# EAGLE schematic Capture_Points_Arduino_nRF24L01_Eagle (EAGLE 9.0.1)
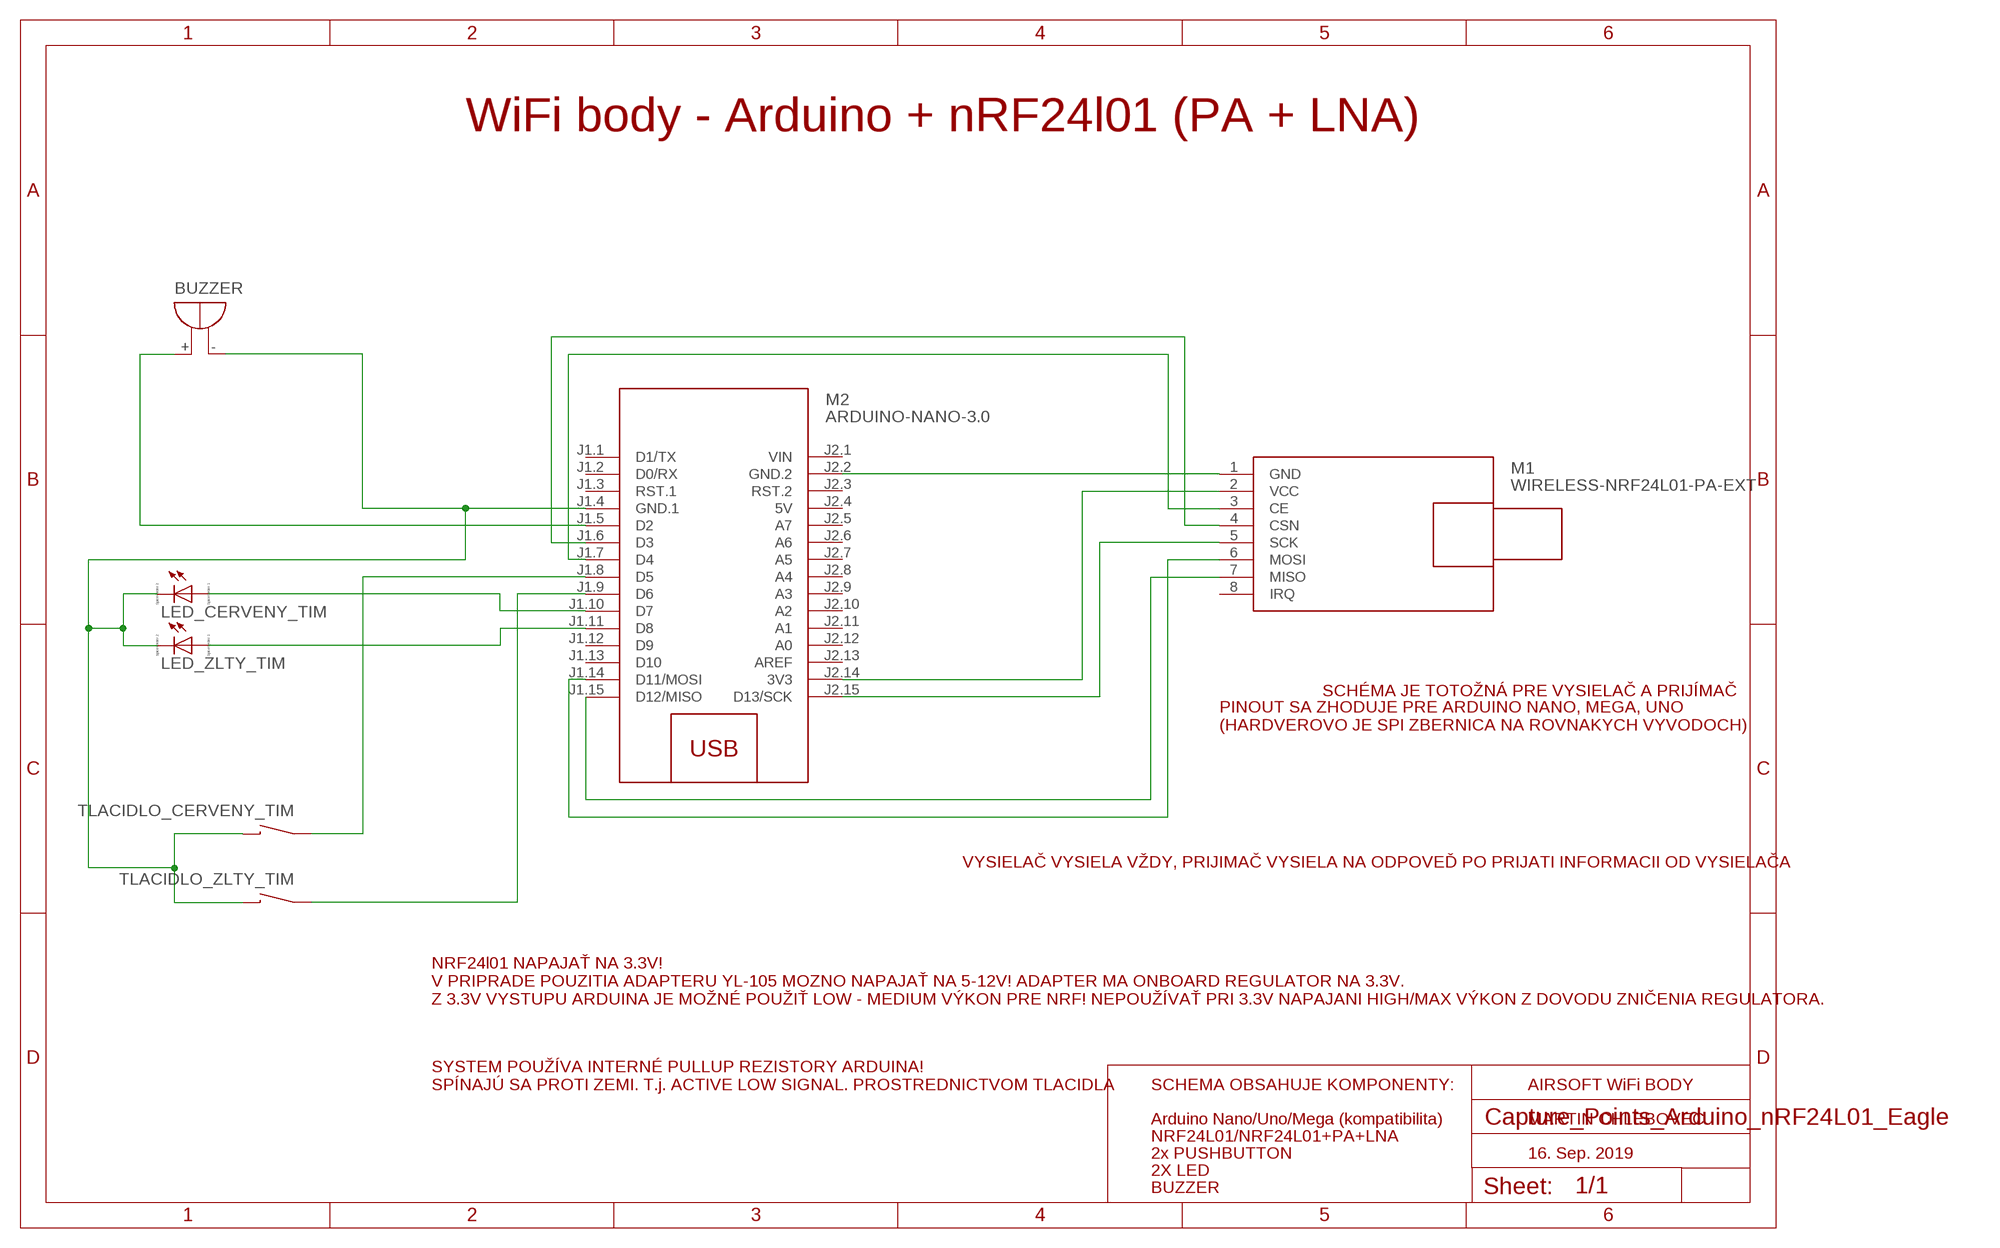
[diagram p0: schematic, sheet 1]

## Parts
BUZZER  F/BC40  [F/BC40]
LED_CERVENY_TIM  LED_E  [LED_1206]
LED_ZLTY_TIM  LED_E  [LED_1206]
M1  WIRELESS-NRF24L01-PA-EXT  [WIRELESS-NRF24L01-PA-EXT]
M2  ARDUINO-NANO-3.0  [ARDUINO-NANO-3.0]
TLACIDLO_CERVENY_TIM  FINGERPAD-2B  [FINGERPAD-2B]
TLACIDLO_ZLTY_TIM  FINGERPAD-2B  [FINGERPAD-2B]

## Nets
N$1: M1.3(CE) M2.J1.7(D4)
N$2: M1.1(GND) M2.J2.2(GND.2)
N$3: M1.2(VCC) M2.J2.14(3V3)
N$4: M1.4(CSN) M2.J1.6(D3)
N$5: M1.5(SCK) M2.J2.15(D13/SCK)
N$6: M1.6(MOSI) M2.J1.14(D11/MOSI)
N$7: M1.7(MISO) M2.J1.15(D12/MISO)
N$8: BUZZER.- LED_CERVENY_TIM.C LED_ZLTY_TIM.C M2.J1.4(GND.1) TLACIDLO_CERVENY_TIM.2 TLACIDLO_ZLTY_TIM.2
N$9: BUZZER.+ M2.J1.5(D2)
N$10: LED_CERVENY_TIM.A M2.J1.10(D7)
N$11: LED_ZLTY_TIM.A M2.J1.11(D8)
N$13: M2.J1.8(D5) TLACIDLO_CERVENY_TIM.1
N$14: M2.J1.9(D6) TLACIDLO_ZLTY_TIM.1
Unconnected: M1.8(IRQ) M2.J1.1(D1/TX) M2.J1.2(D0/RX) M2.J1.3(RST.1) M2.J1.12(D9) M2.J1.13(D10) M2.J2.3(RST.2) M2.J2.5(A7) M2.J2.6(A6) M2.J2.7(A5) M2.J2.8(A4) M2.J2.9(A3) M2.J2.10(A2) M2.J2.11(A1) M2.J2.12(A0) M2.J2.13(AREF)

## Notes on the sheet
- WiFi body - Arduino + nRF24l01 (PA + LNA)
- SCHÉMA JE TOTOŽNÁ PRE VYSIELAČ A PRIJÍMAČ
- PINOUT SA ZHODUJE PRE ARDUINO NANO, MEGA, UNO 
  (HARDVEROVO JE SPI ZBERNICA NA ROVNAKYCH VYVODOCH)
- VYSIELAČ VYSIELA VŽDY, PRIJIMAČ VYSIELA NA ODPOVEĎ PO PRIJATI INFORMACII OD VYSIELAČA
- NRF24l01 NAPAJAŤ NA 3.3V!
  V PRIPRADE POUZITIA ADAPTERU YL-105 MOZNO NAPAJAŤ NA 5-12V! ADAPTER MA ONBOARD REGULATOR NA 3.3V.
  Z 3.3V VYSTUPU ARDUINA JE MOŽNÉ POUŽIŤ LOW - MEDIUM VÝKON PRE NRF! NEPOUŽÍVAŤ PRI 3.3V NAPAJANI HIGH/MAX VÝKON Z DOVODU ZNIČENIA REGULATORA.
- SYSTEM POUŽÍVA INTERNÉ PULLUP REZISTORY ARDUINA!
  SPÍNAJÚ SA PROTI ZEMI. T.j. ACTIVE LOW SIGNAL. PROSTREDNICTVOM TLACIDLA
- SCHEMA OBSAHUJE KOMPONENTY: | AIRSOFT WiFi BODY
- Arduino Nano/Uno/Mega (kompatibilita) | MARTIN CHLEBOVEC
- NRF24L01/NRF24L01+PA+LNA
- 2x PUSHBUTTON | 16. Sep. 2019
- 2X LED
- BUZZER

## Power pins joined to a net without a drawn wire
5V: M2.J2.4(5V)
VIN: M2.J2.1(VIN)

## Library data of the parts
BUZZER = buzzer:F/BC40: BUZZER Source: Spoerle; OC_FARNELL: unknown; OC_NEWARK: unknown
LED_CERVENY_TIM LED_ZLTY_TIM = eagle-ltspice:LED_E: LED Source: http://www.osram.convergy.de Source: www.luxeon.com Source: www.kingbright.com; SPICEMODEL: NONE; SPICEPREFIX: D; SPICETYPE: diode
M1 = diy-modules (1):WIRELESS-NRF24L01-PA-EXT: 2.4 GHz Wireless Module based on NRF24L01 chip with preamplifier and external antenna Click here to find device on ebay.com <http://www.ebay.com/sch/nrf24l01+pa+lna+sma>
M2 = diy-modules (1):ARDUINO-NANO-3.0: Arduino Nano 3.0 and compatible devices More details available here: https://www.arduino.cc/en/Main/ArduinoBoardNano Click here to find device on ebay.com <http://www.ebay.com/sch/arduino+nano>
TLACIDLO_CERVENY_TIM TLACIDLO_ZLTY_TIM = dom-key:FINGERPAD-2B: Source: http://www.polycase.com/uploads/14531129045666549.pdf